# Altium project AMC_FMC_Carrier v2.PrjPcb (part 9 of 9)
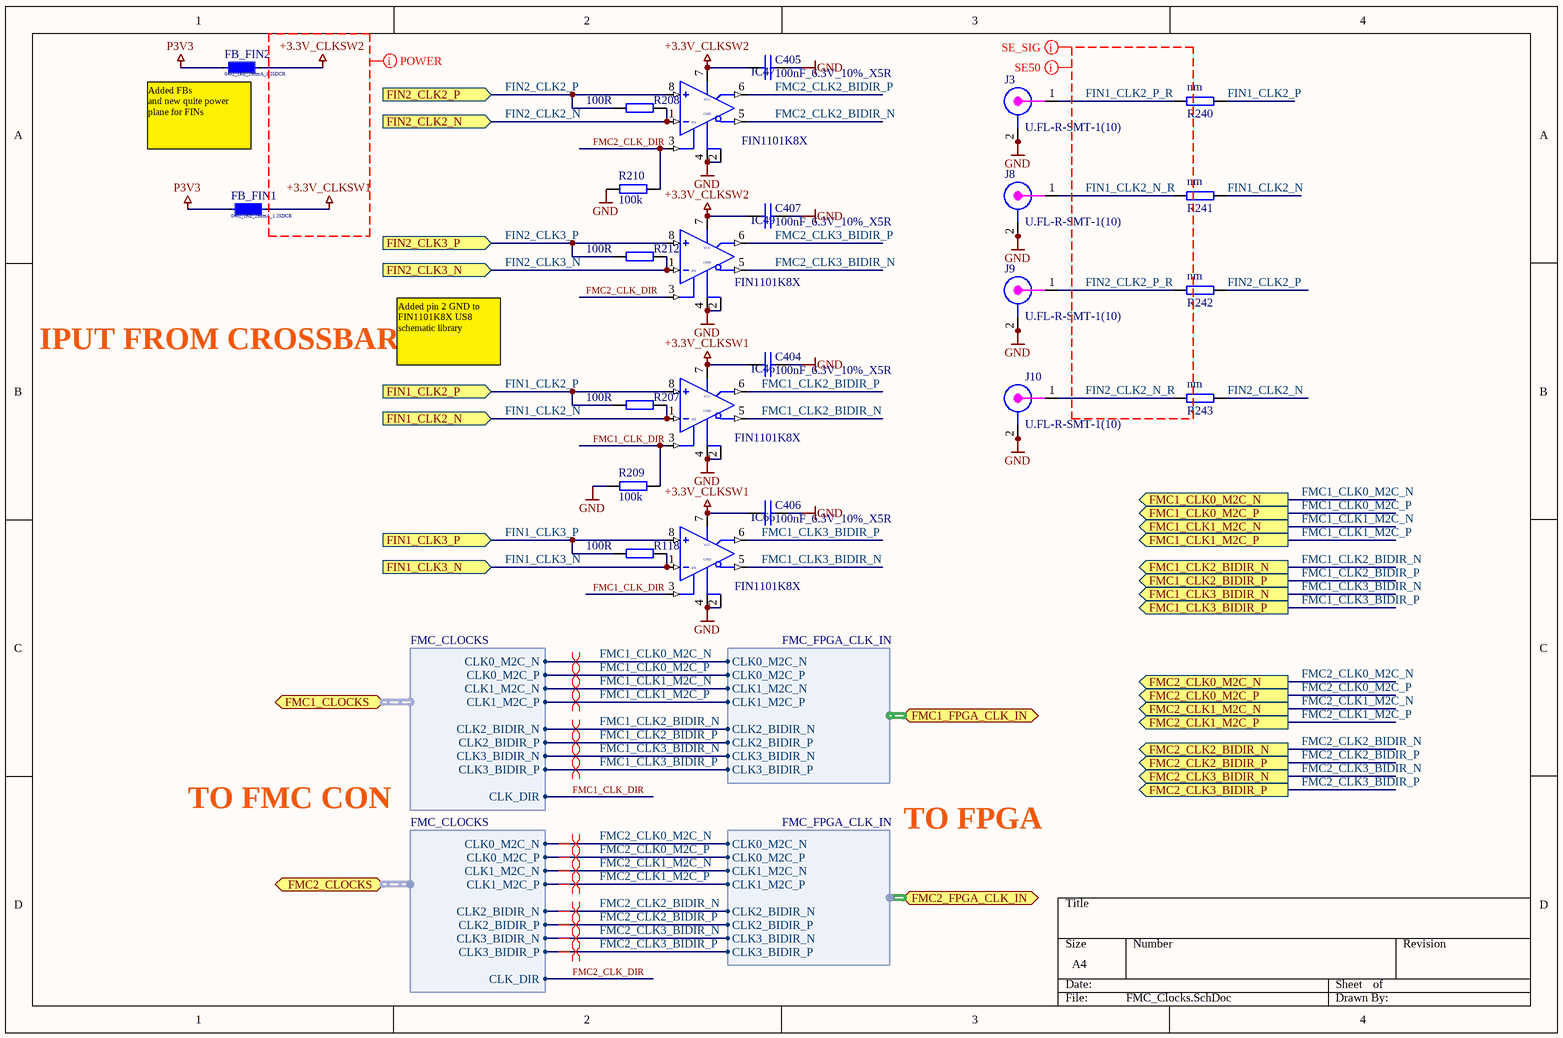
[diagram p21: FMC_Clocks.SchDoc]

## Nets that join several sheets
GND: AMC_FMC_Carrier (43 pins), HPC1 (182 pins), HPC2 (181 pins), FPGA (17 pins), FPGA_SDRAM (5 pins), FMC_HPC1 (16 pins), FMC_HPC2 (7 pins), FPGA_SUP (500 pins), POWER_Management (12 pins), SUP_1.2_1.8 (26 pins), IPMI (5 pins), Thermometers (16 pins), IPMI/UUART (9 pins), JTAG_Configuration (20 pins), M-LVDS PHY (65 pins), UUART (9 pins), Clock_WR (56 pins), FMC_Clocks (22 pins)
MGTAVTT_G10: FPGA_MGT (R239.1), FPGA_SUP (21 pins)
MGTAVTT_G11: FPGA_MGT (R142.1), FPGA_SUP (21 pins)
P1V2: FPGA_SUP (FB7.1 FB8.1), SUP_1.2_1.8 (9 pins)
P1V5: FPGA_SUP (30 pins), M-LVDS PHY (20 pins)
P1V8: FPGA_SUP (L12.1), SUP_1.2_1.8 (9 pins)
P3V3: FPGA (24 pins), FMC_HPC1 (LD1.4), FPGA_SUP (5 pins), POWER_Management (IC58.4 R268.2), JTAG_Configuration (11 pins), M-LVDS PHY (50 pins), Clock_WR (5 pins), FMC_Clocks (FB_FIN1.1 FB_FIN2.1)
P3V3MP: FMC_HPC1 (C102.1 IC56.7 R179.2), POWER_Management (F1.1 F2.1 F3.1), SUP_1.2_1.8 (R66.1 R77.1), Thermometers (19 pins)
P12V: POWER_Management (C88.1 J2.4 R266.2 R267.2), SUP_1.2_1.8 (6 pins)
PVADJ1: HPC1 (8 pins), FMC_HPC1 (C100.1 IC56.2 R83.2 R178.2), FPGA_SUP (70 pins)
PVADJ2: HPC2 (8 pins), FMC_HPC2 (R270.1), FPGA_SUP (69 pins)
3P3VAUX_R: AMC_FMC_Carrier (R124.2), HPC2 (J1B.c34)
CPU.SCL: FMC_HPC1 (IC56.6), Thermometers (5 pins)
CPU.SDA: FMC_HPC1 (IC56.5), Thermometers (5 pins)
DP1.DP0_C2M_N: HPC1 (J1A.c3), FPGA_MGT (C179.1)
DP1.DP0_C2M_P: HPC1 (J1A.c2), FPGA_MGT (C178.1)
DP1.DP0_M2C_N: HPC1 (J1A.c7), FPGA_MGT (C181.1)
DP1.DP0_M2C_P: HPC1 (J1A.c6), FPGA_MGT (C180.1)
DP1.DP1_C2M_N: HPC1 (J1A.a23), FPGA_MGT (C185.1)
DP1.DP1_C2M_P: HPC1 (J1A.a22), FPGA_MGT (C184.1)
DP1.DP1_M2C_N: HPC1 (J1A.a3), FPGA_MGT (C187.1)
DP1.DP1_M2C_P: HPC1 (J1A.a2), FPGA_MGT (C186.1)
DP1.DP2_C2M_N: HPC1 (J1A.a27), FPGA_MGT (C191.1)
DP1.DP2_C2M_P: HPC1 (J1A.a26), FPGA_MGT (C190.1)
DP1.DP2_M2C_N: HPC1 (J1A.a7), FPGA_MGT (C193.1)
DP1.DP2_M2C_P: HPC1 (J1A.a6), FPGA_MGT (C192.1)
DP1.DP3_C2M_N: HPC1 (J1A.a31), FPGA_MGT (C195.1)
DP1.DP3_C2M_P: HPC1 (J1A.a30), FPGA_MGT (C194.1)
DP1.DP3_M2C_N: HPC1 (J1A.a11), FPGA_MGT (C197.1)
DP1.DP3_M2C_P: HPC1 (J1A.a10), FPGA_MGT (C196.1)
DP2.DP0_C2M_N: HPC2 (J1B.c3), FPGA_MGT (C199.1)
DP2.DP0_C2M_P: HPC2 (J1B.c2), FPGA_MGT (C198.1)
DP2.DP0_M2C_N: HPC2 (J1B.c7), FPGA_MGT (C201.1)
DP2.DP0_M2C_P: HPC2 (J1B.c6), FPGA_MGT (C200.1)
DP2.DP1_C2M_N: HPC2 (J1B.a23), FPGA_MGT (C205.1)
DP2.DP1_C2M_P: HPC2 (J1B.a22), FPGA_MGT (C204.1)
DP2.DP1_M2C_N: HPC2 (J1B.a3), FPGA_MGT (C207.1)
DP2.DP1_M2C_P: HPC2 (J1B.a2), FPGA_MGT (C206.1)
DP2.DP2_C2M_N: HPC2 (J1B.a27), FPGA_MGT (C629.1)
DP2.DP2_C2M_P: HPC2 (J1B.a26), FPGA_MGT (C627.1)
DP2.DP2_M2C_N: HPC2 (J1B.a7), FPGA_MGT (C633.1)
DP2.DP2_M2C_P: HPC2 (J1B.a6), FPGA_MGT (C631.1)
DP2.DP3_C2M_N: HPC2 (J1B.a31), FPGA_MGT (C628.1)
DP2.DP3_C2M_P: HPC2 (J1B.a30), FPGA_MGT (C626.1)
DP2.DP3_M2C_N: HPC2 (J1B.a11), FPGA_MGT (C632.1)
DP2.DP3_M2C_P: HPC2 (J1B.a10), FPGA_MGT (C630.1)
FJTAG.TCK: FPGA (IC2.AE12), JTAG_Configuration (IC6.46 R164.1)
FJTAG.TDI: FPGA (IC2.AE14), JTAG_Configuration (IC6.43)
FJTAG.TDO: FPGA (IC2.AD13), JTAG_Configuration (IC6.44)
FJTAG.TMS: FPGA (IC2.AE13), JTAG_Configuration (IC6.45 R225.1)
FLASH_CLK: FPGA (R293.1), FMC_HPC1 (IC2.J8)
FLASH_CSn: FPGA (R299.1), FMC_HPC1 (IC2.J9)
FSPI.FCS_~{B}: FPGA (IC13.1 IC17.7 R127.1), FMC_HPC2 (IC2.Y27)
FSPI.FLASH_D2: FPGA (R126.1 R303.1), FMC_HPC2 (IC2.V26)
FSPI.FLASH_D3: FPGA (R133.1 R304.1), FMC_HPC2 (IC2.V27)
FSPI.FLASH_Q/D1: FPGA (R125.2 R298.2), FMC_HPC2 (IC2.V29)
FSPI.FLASH_SI/D0: FPGA (IC13.5 IC17.15 R291.1), FMC_HPC2 (IC2.V28)
FTMP.DXN: FPGA (IC2.W17), Thermometers (C97.2 R135.1)
FTMP.DXP: FPGA (IC2.W18), Thermometers (C97.1 IC18.3)
GBT1.GBTCLK0_M2C_N: HPC1 (J1A.d5), FPGA_MGT (C183.1)
GBT1.GBTCLK0_M2C_P: HPC1 (J1A.d4), FPGA_MGT (C182.1)
GBT1.GBTCLK1_M2C_N: HPC1 (J1A.b21), FPGA_MGT (C189.1)
GBT1.GBTCLK1_M2C_P: HPC1 (J1A.b20), FPGA_MGT (C188.1)
GBT2.GBTCLK0_M2C_N: HPC2 (J1B.d5), FPGA_MGT (C203.1)
GBT2.GBTCLK0_M2C_P: HPC2 (J1B.d4), FPGA_MGT (C202.1)
GBT2.GBTCLK1_M2C_N: HPC2 (J1B.b21), FPGA_MGT (C635.1)
GBT2.GBTCLK1_M2C_P: HPC2 (J1B.b20), FPGA_MGT (C634.1)
HA1.HA00_CC_N: HPC1 (J1A.f5), FMC_HPC1 (IC2.H29)
HA1.HA00_CC_P: HPC1 (J1A.f4), FMC_HPC1 (IC2.J29)
HA1.HA01_CC_N: HPC1 (J1A.e3), FMC_HPC1 (IC2.K28)
HA1.HA01_CC_P: HPC1 (J1A.e2), FMC_HPC1 (IC2.L28)
HA1.HA02_N: HPC1 (J1A.k8), FMC_HPC1 (IC2.K33)
HA1.HA02_P: HPC1 (J1A.k7), FMC_HPC1 (IC2.J34)
HA1.HA03_N: HPC1 (J1A.j7), FMC_HPC1 (IC2.J30)
HA1.HA03_P: HPC1 (J1A.j6), FMC_HPC1 (IC2.K30)
HA1.HA04_N: HPC1 (J1A.f8), FMC_HPC1 (IC2.L33)
HA1.HA04_P: HPC1 (J1A.f7), FMC_HPC1 (IC2.L34)
HA1.HA05_N: HPC1 (J1A.e7), FMC_HPC1 (IC2.J33)
HA1.HA05_P: HPC1 (J1A.e6), FMC_HPC1 (IC2.H34)
HA1.HA06_N: HPC1 (J1A.k11), FMC_HPC1 (IC2.L27)
HA1.HA06_P: HPC1 (J1A.k10), FMC_HPC1 (IC2.K27)
HA1.HA07_N: HPC1 (J1A.j10), FMC_HPC1 (IC2.L32)
HA1.HA07_P: HPC1 (J1A.j9), FMC_HPC1 (IC2.K32)
HA1.HA08_N: HPC1 (J1A.f11), FMC_HPC1 (IC2.L29)
HA1.HA08_P: HPC1 (J1A.f10), FMC_HPC1 (IC2.L30)
HA1.HA09_N: HPC1 (J1A.e10), FMC_HPC1 (IC2.K31)
HA1.HA09_P: HPC1 (J1A.e9), FMC_HPC1 (IC2.J31)
HA1.HA10_N: HPC1 (J1A.k14), FMC_HPC1 (IC2.H32)
HA1.HA10_P: HPC1 (J1A.k13), FMC_HPC1 (IC2.G32)
HA1.HA11_N: HPC1 (J1A.j13), FMC_HPC1 (IC2.M25)
HA1.HA11_P: HPC1 (J1A.j12), FMC_HPC1 (IC2.L25)
HA1.HA12_N: HPC1 (J1A.f14), FMC_HPC1 (IC2.H33)
HA1.HA12_P: HPC1 (J1A.f13), FMC_HPC1 (IC2.G34)
HA1.HA13_N: HPC1 (J1A.e13), FMC_HPC1 (IC2.J25)
HA1.HA13_P: HPC1 (J1A.e12), FMC_HPC1 (IC2.K25)
HA1.HA14_N: HPC1 (J1A.j16), FMC_HPC1 (IC2.M24)
HA1.HA14_P: HPC1 (J1A.j15), FMC_HPC1 (IC2.L24)
HA1.HA15_N: HPC1 (J1A.f17), FMC_HPC1 (IC2.G29)
HA1.HA15_P: HPC1 (J1A.f16), FMC_HPC1 (IC2.G30)
HA1.HA16_N: HPC1 (J1A.e16), FMC_HPC1 (IC2.H31)
HA1.HA16_P: HPC1 (J1A.e15), FMC_HPC1 (IC2.G31)
HA1.HA17_CC_N: HPC1 (J1A.k17), FMC_HPC1 (IC2.H28)
HA1.HA17_CC_P: HPC1 (J1A.k16), FMC_HPC1 (IC2.J28)
HA1.HA18_N: HPC1 (J1A.j19), FMC_HPC1 (IC2.H27)
HA1.HA18_P: HPC1 (J1A.j18), FMC_HPC1 (IC2.G27)
HA1.HA19_N: HPC1 (J1A.f20), FMC_HPC1 (IC2.H26)
HA1.HA19_P: HPC1 (J1A.f19), FMC_HPC1 (IC2.G26)
HA1.HA20_N: HPC1 (J1A.e19), FMC_HPC1 (IC2.J26)
HA1.HA20_P: HPC1 (J1A.e18), FMC_HPC1 (IC2.K26)
HA1.HA21_N: HPC1 (J1A.k20), FMC_HPC1 (IC2.G24)
HA1.HA21_P: HPC1 (J1A.k19), FMC_HPC1 (IC2.G25)
HA1.HA22_N: HPC1 (J1A.j22), FMC_HPC1 (IC2.J24)
HA1.HA22_P: HPC1 (J1A.j21), FMC_HPC1 (IC2.H24)
HA1.HA23_N: HPC1 (J1A.k23), FMC_HPC1 (IC2.K23)
HA1.HA23_P: HPC1 (J1A.k22), FMC_HPC1 (IC2.J23)
HA2.HA00_CC_N: HPC2 (J1B.f5), FMC_HPC2 (IC2.AL30)
HA2.HA00_CC_P: HPC2 (J1B.f4), FMC_HPC2 (IC2.AM30)
HA2.HA01_CC_N: HPC2 (J1B.e3), FMC_HPC2 (IC2.AL29)
HA2.HA01_CC_P: HPC2 (J1B.e2), FMC_HPC2 (IC2.AL28)
HA2.HA02_N: HPC2 (J1B.k8), FMC_HPC2 (IC2.AN31)
HA2.HA02_P: HPC2 (J1B.k7), FMC_HPC2 (IC2.AP31)
HA2.HA03_N: HPC2 (J1B.j7), FMC_HPC2 (IC2.AN26)
HA2.HA03_P: HPC2 (J1B.j6), FMC_HPC2 (IC2.AM26)
HA2.HA04_N: HPC2 (J1B.f8), FMC_HPC2 (IC2.AJ25)
HA2.HA04_P: HPC2 (J1B.f7), FMC_HPC2 (IC2.AK25)
HA2.HA05_N: HPC2 (J1B.e7), FMC_HPC2 (IC2.AM25)
HA2.HA05_P: HPC2 (J1B.e6), FMC_HPC2 (IC2.AL25)
HA2.HA06_N: HPC2 (J1B.k11), FMC_HPC2 (IC2.AL32)
HA2.HA06_P: HPC2 (J1B.k10), FMC_HPC2 (IC2.AM32)
HA2.HA07_N: HPC2 (J1B.j10), FMC_HPC2 (IC2.AM31)
HA2.HA07_P: HPC2 (J1B.j9), FMC_HPC2 (IC2.AN32)
HA2.HA08_N: HPC2 (J1B.f11), FMC_HPC2 (IC2.AM27)
HA2.HA08_P: HPC2 (J1B.f10), FMC_HPC2 (IC2.AN27)
HA2.HA09_N: HPC2 (J1B.e10), FMC_HPC2 (IC2.AJ26)
HA2.HA09_P: HPC2 (J1B.e9), FMC_HPC2 (IC2.AK26)
HA2.HA10_N: HPC2 (J1B.k14), FMC_HPC2 (IC2.AP26)
HA2.HA10_P: HPC2 (J1B.k13), FMC_HPC2 (IC2.AP25)
HA2.HA11_N: HPC2 (J1B.j13), FMC_HPC2 (IC2.AK33)
HA2.HA11_P: HPC2 (J1B.j12), FMC_HPC2 (IC2.AL33)
HA2.HA12_N: HPC2 (J1B.f14), FMC_HPC2 (IC2.AM29)
HA2.HA12_P: HPC2 (J1B.f13), FMC_HPC2 (IC2.AN29)
HA2.HA13_N: HPC2 (J1B.e13), FMC_HPC2 (IC2.AN28)
HA2.HA13_P: HPC2 (J1B.e12), FMC_HPC2 (IC2.AP28)
HA2.HA14_N: HPC2 (J1B.j16), FMC_HPC2 (IC2.AN34)
HA2.HA14_P: HPC2 (J1B.j15), FMC_HPC2 (IC2.AP34)
HA2.HA15_N: HPC2 (J1B.f17), FMC_HPC2 (IC2.AK30)
HA2.HA15_P: HPC2 (J1B.f16), FMC_HPC2 (IC2.AJ29)
HA2.HA16_N: HPC2 (J1B.e16), FMC_HPC2 (IC2.AK27)
HA2.HA16_P: HPC2 (J1B.e15), FMC_HPC2 (IC2.AL27)
HA2.HA17_CC_N: HPC2 (J1B.k17), FMC_HPC2 (IC2.AJ28)
HA2.HA17_CC_P: HPC2 (J1B.k16), FMC_HPC2 (IC2.AK28)
HA2.HA18_N: HPC2 (J1B.j19), FMC_HPC2 (IC2.AN33)
HA2.HA18_P: HPC2 (J1B.j18), FMC_HPC2 (IC2.AP33)
HA2.HA19_N: HPC2 (J1B.f20), FMC_HPC2 (IC2.AJ30)
HA2.HA19_P: HPC2 (J1B.f19), FMC_HPC2 (IC2.AK31)
HA2.HA20_N: HPC2 (J1B.e19), FMC_HPC2 (IC2.AJ31)
HA2.HA20_P: HPC2 (J1B.e18), FMC_HPC2 (IC2.AK32)
HA2.HA21_N: HPC2 (J1B.k20), FMC_HPC2 (IC2.AP30)
HA2.HA21_P: HPC2 (J1B.k19), FMC_HPC2 (IC2.AP29)
HA2.HA22_N: HPC2 (J1B.j22), FMC_HPC2 (IC2.AL34)
HA2.HA22_P: HPC2 (J1B.j21), FMC_HPC2 (IC2.AM34)
HA2.HA23_N: HPC2 (J1B.k23), FMC_HPC2 (IC2.AJ33)
HA2.HA23_P: HPC2 (J1B.k22), FMC_HPC2 (IC2.AJ34)
HB1.HB00_CC_N: HPC1 (J1A.k26), FMC_HPC1 (IC2.W5)
HB1.HB00_CC_P: HPC1 (J1A.k25), FMC_HPC1 (IC2.Y5)
HB1.HB01_N: HPC1 (J1A.j25), FMC_HPC1 (IC2.W8)
HB1.HB01_P: HPC1 (J1A.j24), FMC_HPC1 (IC2.W9)
HB1.HB02_N: HPC1 (J1A.f23), FMC_HPC1 (IC2.V8)
HB1.HB02_P: HPC1 (J1A.f22), FMC_HPC1 (IC2.V9)
HB1.HB03_N: HPC1 (J1A.e22), FMC_HPC1 (IC2.Y10)
HB1.HB03_P: HPC1 (J1A.e21), FMC_HPC1 (IC2.W10)
HB1.HB04_N: HPC1 (J1A.f26), FMC_HPC1 (IC2.Y7)
HB1.HB04_P: HPC1 (J1A.f25), FMC_HPC1 (IC2.Y8)
HB1.HB05_N: HPC1 (J1A.e25), FMC_HPC1 (IC2.AA9)
HB1.HB05_P: HPC1 (J1A.e24), FMC_HPC1 (IC2.AA10)
HB1.HB06_CC_N: HPC1 (J1A.k29), FMC_HPC1 (IC2.W4)
HB1.HB06_CC_P: HPC1 (J1A.k28), FMC_HPC1 (IC2.V4)
HB1.HB07_N: HPC1 (J1A.j28), FMC_HPC1 (IC2.AB9)
HB1.HB07_P: HPC1 (J1A.j27), FMC_HPC1 (IC2.AB10)
HB1.HB08_N: HPC1 (J1A.f29), FMC_HPC1 (IC2.W3)
HB1.HB08_P: HPC1 (J1A.f28), FMC_HPC1 (IC2.V3)
HB1.HB09_N: HPC1 (J1A.e28), FMC_HPC1 (IC2.V1)
HB1.HB09_P: HPC1 (J1A.e27), FMC_HPC1 (IC2.V2)
HB1.HB10_N: HPC1 (J1A.k32), FMC_HPC1 (IC2.V6)
HB1.HB10_P: HPC1 (J1A.k31), FMC_HPC1 (IC2.V7)
HB1.HB11_N: HPC1 (J1A.j31), FMC_HPC1 (IC2.Y1)
HB1.HB11_P: HPC1 (J1A.j30), FMC_HPC1 (IC2.W1)
HB1.HB12_N: HPC1 (J1A.f32), FMC_HPC1 (IC2.AC6)
HB1.HB12_P: HPC1 (J1A.f31), FMC_HPC1 (IC2.AC7)
HB1.HB13_N: HPC1 (J1A.e31), FMC_HPC1 (IC2.Y2)
HB1.HB13_P: HPC1 (J1A.e30), FMC_HPC1 (IC2.Y3)
HB1.HB14_N: HPC1 (J1A.k35), FMC_HPC1 (IC2.AC1)
HB1.HB14_P: HPC1 (J1A.k34), FMC_HPC1 (IC2.AC2)
HB1.HB15_N: HPC1 (J1A.j34), FMC_HPC1 (IC2.AC8)
HB1.HB15_P: HPC1 (J1A.j33), FMC_HPC1 (IC2.AC9)
HB1.HB16_N: HPC1 (J1A.f35), FMC_HPC1 (IC2.AB1)
HB1.HB16_P: HPC1 (J1A.f34), FMC_HPC1 (IC2.AB2)
HB1.HB17_CC_N: HPC1 (J1A.k38), FMC_HPC1 (IC2.AA4)
HB1.HB17_CC_P: HPC1 (J1A.k37), FMC_HPC1 (IC2.AA5)
HB1.HB18_N: HPC1 (J1A.j37), FMC_HPC1 (IC2.AB6)
HB1.HB18_P: HPC1 (J1A.j36), FMC_HPC1 (IC2.AB7)
HB1.HB19_N: HPC1 (J1A.e34), FMC_HPC1 (IC2.AB4)
HB1.HB19_P: HPC1 (J1A.e33), FMC_HPC1 (IC2.AB5)
HB1.HB20_N: HPC1 (J1A.f38), FMC_HPC1 (IC2.AA2)
HB1.HB20_P: HPC1 (J1A.f37), FMC_HPC1 (IC2.AA3)
HB1.HB21_N: HPC1 (J1A.e37), FMC_HPC1 (IC2.AC4)
HB1.HB21_P: HPC1 (J1A.e36), FMC_HPC1 (IC2.AC3)
HB2.HB00_CC_N: HPC2 (J1B.k26), FMC_HPC2 (IC2.T29)
HB2.HB00_CC_P: HPC2 (J1B.k25), FMC_HPC2 (IC2.U29)
HB2.HB01_N: HPC2 (J1B.j25), FMC_HPC2 (IC2.N26)
HB2.HB01_P: HPC2 (J1B.j24), FMC_HPC2 (IC2.M27)
HB2.HB02_N: HPC2 (J1B.f23), FMC_HPC2 (IC2.N34)
HB2.HB02_P: HPC2 (J1B.f22), FMC_HPC2 (IC2.M34)
HB2.HB03_N: HPC2 (J1B.e22), FMC_HPC2 (IC2.T34)
HB2.HB03_P: HPC2 (J1B.e21), FMC_HPC2 (IC2.U34)
HB2.HB04_N: HPC2 (J1B.f26), FMC_HPC2 (IC2.U27)
HB2.HB04_P: HPC2 (J1B.f25), FMC_HPC2 (IC2.U26)
HB2.HB05_N: HPC2 (J1B.e25), FMC_HPC2 (IC2.P34)
HB2.HB05_P: HPC2 (J1B.e24), FMC_HPC2 (IC2.P33)
HB2.HB06_CC_N: HPC2 (J1B.k29), FMC_HPC2 (IC2.P30)
HB2.HB06_CC_P: HPC2 (J1B.k28), FMC_HPC2 (IC2.R30)
HB2.HB07_N: HPC2 (J1B.j28), FMC_HPC2 (IC2.P24)
HB2.HB07_P: HPC2 (J1B.j27), FMC_HPC2 (IC2.N24)
HB2.HB08_N: HPC2 (J1B.f29), FMC_HPC2 (IC2.P26)
HB2.HB08_P: HPC2 (J1B.f28), FMC_HPC2 (IC2.R26)
HB2.HB09_N: HPC2 (J1B.e28), FMC_HPC2 (IC2.R28)
HB2.HB09_P: HPC2 (J1B.e27), FMC_HPC2 (IC2.T28)
HB2.HB10_N: HPC2 (J1B.k32), FMC_HPC2 (IC2.U25)
HB2.HB10_P: HPC2 (J1B.k31), FMC_HPC2 (IC2.T25)
HB2.HB11_N: HPC2 (J1B.j31), FMC_HPC2 (IC2.T27)
HB2.HB11_P: HPC2 (J1B.j30), FMC_HPC2 (IC2.R27)
HB2.HB12_N: HPC2 (J1B.f32), FMC_HPC2 (IC2.M32)
HB2.HB12_P: HPC2 (J1B.f31), FMC_HPC2 (IC2.N31)
HB2.HB13_N: HPC2 (J1B.e31), FMC_HPC2 (IC2.N28)
HB2.HB13_P: HPC2 (J1B.e30), FMC_HPC2 (IC2.N27)
HB2.HB14_N: HPC2 (J1B.k35), FMC_HPC2 (IC2.P31)
HB2.HB14_P: HPC2 (J1B.k34), FMC_HPC2 (IC2.R31)
HB2.HB15_N: HPC2 (J1B.j34), FMC_HPC2 (IC2.T30)
HB2.HB15_P: HPC2 (J1B.j33), FMC_HPC2 (IC2.U30)
HB2.HB16_N: HPC2 (J1B.f35), FMC_HPC2 (IC2.U31)
HB2.HB16_P: HPC2 (J1B.f34), FMC_HPC2 (IC2.U32)
HB2.HB17_CC_N: HPC2 (J1B.k38), FMC_HPC2 (IC2.P28)
HB2.HB17_CC_P: HPC2 (J1B.k37), FMC_HPC2 (IC2.P29)
HB2.HB18_N: HPC2 (J1B.j37), FMC_HPC2 (IC2.M29)
HB2.HB18_P: HPC2 (J1B.j36), FMC_HPC2 (IC2.N29)
HB2.HB19_N: HPC2 (J1B.e34), FMC_HPC2 (IC2.M30)
HB2.HB19_P: HPC2 (J1B.e33), FMC_HPC2 (IC2.M31)
HB2.HB20_N: HPC2 (J1B.f38), FMC_HPC2 (IC2.N33)
HB2.HB20_P: HPC2 (J1B.f37), FMC_HPC2 (IC2.N32)
HB2.HB21_N: HPC2 (J1B.e37), FMC_HPC2 (IC2.R33)
HB2.HB21_P: HPC2 (J1B.e36), FMC_HPC2 (IC2.T33)
JTAG1.TCK: HPC1 (J1A.d29), JTAG_Configuration (IC6.37)
JTAG1.TDI: HPC1 (J1A.d30), JTAG_Configuration (IC6.32)
JTAG1.TDO: HPC1 (J1A.d31), JTAG_Configuration (IC6.33)
JTAG1.TMS: HPC1 (J1A.d33), JTAG_Configuration (IC6.34)
JTAG1.TRST_L: HPC1 (J1A.d34), JTAG_Configuration (IC6.38)
JTAG2.TCK: HPC2 (J1B.d29), JTAG_Configuration (IC6.26)
JTAG2.TDI: HPC2 (J1B.d30), JTAG_Configuration (IC6.20)
JTAG2.TDO: HPC2 (J1B.d31), JTAG_Configuration (IC6.19)
JTAG2.TMS: HPC2 (J1B.d33), JTAG_Configuration (IC6.23)
JTAG2.TRST_L: HPC2 (J1B.d34), JTAG_Configuration (IC6.27)
LA1.LA00_CC_N: HPC1 (J1A.g7), FMC_HPC1 (IC2.K6)
LA1.LA00_CC_P: HPC1 (J1A.g6), FMC_HPC1 (IC2.K7)
LA1.LA01_CC_N: HPC1 (J1A.d9), FMC_HPC1 (IC2.J5)
LA1.LA01_CC_P: HPC1 (J1A.d8), FMC_HPC1 (IC2.J6)
LA1.LA02_N: HPC1 (J1A.h8), FMC_HPC1 (IC2.G6)
LA1.LA02_P: HPC1 (J1A.h7), FMC_HPC1 (IC2.G7)
LA1.LA03_N: HPC1 (J1A.g10), FMC_HPC1 (IC2.H1)
LA1.LA03_P: HPC1 (J1A.g9), FMC_HPC1 (IC2.G1)
LA1.LA04_N: HPC1 (J1A.h11), FMC_HPC1 (IC2.K1)
LA1.LA04_P: HPC1 (J1A.h10), FMC_HPC1 (IC2.J1)
LA1.LA05_N: HPC1 (J1A.d12), FMC_HPC1 (IC2.H3)
LA1.LA05_P: HPC1 (J1A.d11), FMC_HPC1 (IC2.H4)
LA1.LA06_N: HPC1 (J1A.c11), FMC_HPC1 (IC2.L5)
LA1.LA06_P: HPC1 (J1A.c10), FMC_HPC1 (IC2.K5)
LA1.LA07_N: HPC1 (J1A.h14), FMC_HPC1 (IC2.K2)
LA1.LA07_P: HPC1 (J1A.h13), FMC_HPC1 (IC2.K3)
LA1.LA08_N: HPC1 (J1A.g13), FMC_HPC1 (IC2.F2)
LA1.LA08_P: HPC1 (J1A.g12), FMC_HPC1 (IC2.F3)
LA1.LA09_N: HPC1 (J1A.d15), FMC_HPC1 (IC2.J3)
LA1.LA09_P: HPC1 (J1A.d14), FMC_HPC1 (IC2.J4)
LA1.LA10_N: HPC1 (J1A.c15), FMC_HPC1 (IC2.H2)
LA1.LA10_P: HPC1 (J1A.c14), FMC_HPC1 (IC2.G2)
LA1.LA11_N: HPC1 (J1A.h17), FMC_HPC1 (IC2.M2)
LA1.LA11_P: HPC1 (J1A.h16), FMC_HPC1 (IC2.L2)
LA1.LA12_N: HPC1 (J1A.g16), FMC_HPC1 (IC2.L8)
LA1.LA12_P: HPC1 (J1A.g15), FMC_HPC1 (IC2.K8)
LA1.LA13_N: HPC1 (J1A.d18), FMC_HPC1 (IC2.G9)
LA1.LA13_P: HPC1 (J1A.d17), FMC_HPC1 (IC2.G10)
LA1.LA14_N: HPC1 (J1A.c19), FMC_HPC1 (IC2.H8)
LA1.LA14_P: HPC1 (J1A.c18), FMC_HPC1 (IC2.H9)
LA1.LA15_N: HPC1 (J1A.h20), FMC_HPC1 (IC2.K11)
LA1.LA15_P: HPC1 (J1A.h19), FMC_HPC1 (IC2.J11)
LA1.LA16_N: HPC1 (J1A.g19), FMC_HPC1 (IC2.L9)
LA1.LA16_P: HPC1 (J1A.g18), FMC_HPC1 (IC2.L10)
LA1.LA17_CC_N: HPC1 (J1A.d21), FMC_HPC1 (IC2.T4)
LA1.LA17_CC_P: HPC1 (J1A.d20), FMC_HPC1 (IC2.T5)
LA1.LA18_CC_N: HPC1 (J1A.c23), FMC_HPC1 (IC2.P3)
LA1.LA18_CC_P: HPC1 (J1A.c22), FMC_HPC1 (IC2.P4)
LA1.LA19_N: HPC1 (J1A.h23), FMC_HPC1 (IC2.U4)
LA1.LA19_P: HPC1 (J1A.h22), FMC_HPC1 (IC2.U5)
LA1.LA20_N: HPC1 (J1A.g22), FMC_HPC1 (IC2.R10)
LA1.LA20_P: HPC1 (J1A.g21), FMC_HPC1 (IC2.P10)
LA1.LA21_N: HPC1 (J1A.h26), FMC_HPC1 (IC2.M7)
LA1.LA21_P: HPC1 (J1A.h25), FMC_HPC1 (IC2.M6)
LA1.LA22_N: HPC1 (J1A.g25), FMC_HPC1 (IC2.M4)
LA1.LA22_P: HPC1 (J1A.g24), FMC_HPC1 (IC2.M5)
LA1.LA23_N: HPC1 (J1A.d24), FMC_HPC1 (IC2.N3)
LA1.LA23_P: HPC1 (J1A.d23), FMC_HPC1 (IC2.N2)
LA1.LA24_N: HPC1 (J1A.h29), FMC_HPC1 (IC2.M11)
LA1.LA24_P: HPC1 (J1A.h28), FMC_HPC1 (IC2.M10)
LA1.LA25_N: HPC1 (J1A.g28), FMC_HPC1 (IC2.N8)
LA1.LA25_P: HPC1 (J1A.g27), FMC_HPC1 (IC2.N7)
LA1.LA26_N: HPC1 (J1A.d27), FMC_HPC1 (IC2.T2)
LA1.LA26_P: HPC1 (J1A.d26), FMC_HPC1 (IC2.T3)
LA1.LA27_N: HPC1 (J1A.c27), FMC_HPC1 (IC2.R2)
LA1.LA27_P: HPC1 (J1A.c26), FMC_HPC1 (IC2.R3)
LA1.LA28_N: HPC1 (J1A.h32), FMC_HPC1 (IC2.T7)
LA1.LA28_P: HPC1 (J1A.h31), FMC_HPC1 (IC2.T8)
LA1.LA29_N: HPC1 (J1A.g31), FMC_HPC1 (IC2.P9)
LA1.LA29_P: HPC1 (J1A.g30), FMC_HPC1 (IC2.P8)
LA1.LA30_N: HPC1 (J1A.h35), FMC_HPC1 (IC2.M1)
LA1.LA30_P: HPC1 (J1A.h34), FMC_HPC1 (IC2.N1)
LA1.LA31_N: HPC1 (J1A.g34), FMC_HPC1 (IC2.U7)
LA1.LA31_P: HPC1 (J1A.g33), FMC_HPC1 (IC2.U6)
LA1.LA32_N: HPC1 (J1A.h38), FMC_HPC1 (IC2.P1)
LA1.LA32_P: HPC1 (J1A.h37), FMC_HPC1 (IC2.R1)
LA1.LA33_N: HPC1 (J1A.g37), FMC_HPC1 (IC2.U2)
LA1.LA33_P: HPC1 (J1A.g36), FMC_HPC1 (IC2.U1)
LA2.LA00_CC_N: HPC2 (J1B.g7), FMC_HPC2 (IC2.AF28)
LA2.LA00_CC_P: HPC2 (J1B.g6), FMC_HPC2 (IC2.AE28)
LA2.LA01_CC_N: HPC2 (J1B.d9), FMC_HPC2 (IC2.AF29)
LA2.LA01_CC_P: HPC2 (J1B.d8), FMC_HPC2 (IC2.AF30)
LA2.LA02_N: HPC2 (J1B.h8), FMC_HPC2 (IC2.AG31)
LA2.LA02_P: HPC2 (J1B.h7), FMC_HPC2 (IC2.AH31)
LA2.LA03_N: HPC2 (J1B.g10), FMC_HPC2 (IC2.AG24)
LA2.LA03_P: HPC2 (J1B.g9), FMC_HPC2 (IC2.AH24)
LA2.LA04_N: HPC2 (J1B.h11), FMC_HPC2 (IC2.AC26)
LA2.LA04_P: HPC2 (J1B.h10), FMC_HPC2 (IC2.AC27)
LA2.LA05_N: HPC2 (J1B.d12), FMC_HPC2 (IC2.AH33)
LA2.LA05_P: HPC2 (J1B.d11), FMC_HPC2 (IC2.AH34)
LA2.LA06_N: HPC2 (J1B.c11), FMC_HPC2 (IC2.AF23)
LA2.LA06_P: HPC2 (J1B.c10), FMC_HPC2 (IC2.AE23)
LA2.LA07_N: HPC2 (J1B.h14), FMC_HPC2 (IC2.AG27)
LA2.LA07_P: HPC2 (J1B.h13), FMC_HPC2 (IC2.AH27)
LA2.LA08_N: HPC2 (J1B.g13), FMC_HPC2 (IC2.AE25)
LA2.LA08_P: HPC2 (J1B.g12), FMC_HPC2 (IC2.AD25)
LA2.LA09_N: HPC2 (J1B.d15), FMC_HPC2 (IC2.AF25)
LA2.LA09_P: HPC2 (J1B.d14), FMC_HPC2 (IC2.AG25)
LA2.LA10_N: HPC2 (J1B.c15), FMC_HPC2 (IC2.AG32)
LA2.LA10_P: HPC2 (J1B.c14), FMC_HPC2 (IC2.AH32)
LA2.LA11_N: HPC2 (J1B.h17), FMC_HPC2 (IC2.AD30)
LA2.LA11_P: HPC2 (J1B.h16), FMC_HPC2 (IC2.AE30)
LA2.LA12_N: HPC2 (J1B.g16), FMC_HPC2 (IC2.AE27)
LA2.LA12_P: HPC2 (J1B.g15), FMC_HPC2 (IC2.AF27)
LA2.LA13_N: HPC2 (J1B.d18), FMC_HPC2 (IC2.AF34)
LA2.LA13_P: HPC2 (J1B.d17), FMC_HPC2 (IC2.AG34)
LA2.LA14_N: HPC2 (J1B.c19), FMC_HPC2 (IC2.AE33)
LA2.LA14_P: HPC2 (J1B.c18), FMC_HPC2 (IC2.AF33)
LA2.LA15_N: HPC2 (J1B.h20), FMC_HPC2 (IC2.AD28)
LA2.LA15_P: HPC2 (J1B.h19), FMC_HPC2 (IC2.AD29)
LA2.LA16_N: HPC2 (J1B.g19), FMC_HPC2 (IC2.AD34)
LA2.LA16_P: HPC2 (J1B.g18), FMC_HPC2 (IC2.AD33)
LA2.LA17_CC_N: HPC2 (J1B.d21), FMC_HPC2 (IC2.AB31)
LA2.LA17_CC_P: HPC2 (J1B.d20), FMC_HPC2 (IC2.AB32)
LA2.LA18_CC_N: HPC2 (J1B.c23), FMC_HPC2 (IC2.W31)
LA2.LA18_CC_P: HPC2 (J1B.c22), FMC_HPC2 (IC2.W30)
LA2.LA19_N: HPC2 (J1B.h23), FMC_HPC2 (IC2.AB26)
LA2.LA19_P: HPC2 (J1B.h22), FMC_HPC2 (IC2.AB27)
LA2.LA20_N: HPC2 (J1B.g22), FMC_HPC2 (IC2.AB25)
LA2.LA20_P: HPC2 (J1B.g21), FMC_HPC2 (IC2.AB24)
LA2.LA21_N: HPC2 (J1B.h26), FMC_HPC2 (IC2.AA32)
LA2.LA21_P: HPC2 (J1B.h25), FMC_HPC2 (IC2.AA33)
LA2.LA22_N: HPC2 (J1B.g25), FMC_HPC2 (IC2.AA24)
LA2.LA22_P: HPC2 (J1B.g24), FMC_HPC2 (IC2.AA25)
LA2.LA23_N: HPC2 (J1B.d24), FMC_HPC2 (IC2.W25)
LA2.LA23_P: HPC2 (J1B.d23), FMC_HPC2 (IC2.Y25)
LA2.LA24_N: HPC2 (J1B.h29), FMC_HPC2 (IC2.Y33)
LA2.LA24_P: HPC2 (J1B.h28), FMC_HPC2 (IC2.Y32)
LA2.LA25_N: HPC2 (J1B.g28), FMC_HPC2 (IC2.AA29)
LA2.LA25_P: HPC2 (J1B.g27), FMC_HPC2 (IC2.AB29)
LA2.LA26_N: HPC2 (J1B.d27), FMC_HPC2 (IC2.AC31)
LA2.LA26_P: HPC2 (J1B.d26), FMC_HPC2 (IC2.AC32)
LA2.LA27_N: HPC2 (J1B.c27), FMC_HPC2 (IC2.AA28)
LA2.LA27_P: HPC2 (J1B.c26), FMC_HPC2 (IC2.AA27)
LA2.LA28_N: HPC2 (J1B.h32), FMC_HPC2 (IC2.W28)
LA2.LA28_P: HPC2 (J1B.h31), FMC_HPC2 (IC2.W29)
LA2.LA29_N: HPC2 (J1B.g31), FMC_HPC2 (IC2.AC33)
LA2.LA29_P: HPC2 (J1B.g30), FMC_HPC2 (IC2.AC34)
LA2.LA30_N: HPC2 (J1B.h35), FMC_HPC2 (IC2.W34)
LA2.LA30_P: HPC2 (J1B.h34), FMC_HPC2 (IC2.W33)
LA2.LA31_N: HPC2 (J1B.g34), FMC_HPC2 (IC2.V31)
LA2.LA31_P: HPC2 (J1B.g33), FMC_HPC2 (IC2.V32)
LA2.LA32_N: HPC2 (J1B.h38), FMC_HPC2 (IC2.AB34)
LA2.LA32_P: HPC2 (J1B.h37), FMC_HPC2 (IC2.AA34)
LA2.LA33_N: HPC2 (J1B.g37), FMC_HPC2 (IC2.V34)
LA2.LA33_P: HPC2 (J1B.g36), FMC_HPC2 (IC2.V33)
MLVDS_F.IO_RX_P17: FPGA_SDRAM (IC2.AM9), M-LVDS PHY (IC28.3)
MLVDS_F.IO_RX_P18: FPGA_SDRAM (IC2.AP10), M-LVDS PHY (IC34.3)
MLVDS_F.IO_RX_P19: FPGA_SDRAM (IC2.AN8), M-LVDS PHY (IC36.3)
MLVDS_F.IO_RX_P20: FPGA_SDRAM (IC2.AL8), M-LVDS PHY (IC38.3)
MLVDS_F.IO_TX_P17: FPGA_SDRAM (IC2.AP11), M-LVDS PHY (IC29.3)
MLVDS_F.IO_TX_P18: FPGA_SDRAM (IC2.AM11), M-LVDS PHY (IC35.3)
MLVDS_F.IO_TX_P19: FPGA_SDRAM (IC2.AP8), M-LVDS PHY (IC37.3)
MLVDS_F.IO_TX_P20: FPGA_SDRAM (IC2.AL9), M-LVDS PHY (IC39.3)
MLVDS_F.~{RE}_DE_RX_P17: FPGA_SDRAM (IC2.AJ10), M-LVDS PHY (IC28.5 IC40.10)
MLVDS_F.~{RE}_DE_RX_P18: FPGA_SDRAM (IC2.AJ11), M-LVDS PHY (IC34.5 IC40.8)
MLVDS_F.~{RE}_DE_RX_P19: FPGA_SDRAM (IC2.AM10), M-LVDS PHY (IC36.5 IC40.6)
MLVDS_F.~{RE}_DE_RX_P20: FPGA_SDRAM (IC2.AN9), M-LVDS PHY (IC38.5 IC40.4)
MLVDS_F.~{RE}_DE_TX_P17: FPGA_SDRAM (IC2.AK11), M-LVDS PHY (IC29.5 IC40.9)
MLVDS_F.~{RE}_DE_TX_P18: FPGA_SDRAM (IC2.AL10), M-LVDS PHY (IC35.5 IC40.7)
MLVDS_F.~{RE}_DE_TX_P19: FPGA_SDRAM (IC2.AN11), M-LVDS PHY (IC37.5 IC40.5)
MLVDS_F.~{RE}_DE_TX_P20: FPGA_SDRAM (IC2.AP9), M-LVDS PHY (IC39.5 IC40.3)
PM.PGOOD_P1V0: POWER_Management (C20.1 IC58.3 R268.1), SUP_1.2_1.8 (R289.1 R290.1)
POWER1.3P3VAUX: HPC1 (C16A.1 C17A.1 J1A.d32), POWER_Management (F1.2)
POWER1.12P0V: HPC1 (7 pins), POWER_Management (5 pins)
POWER2.3P3VAUX: AMC_FMC_Carrier (R124.1), HPC2 (C16B.1 C17B.1 J1B.d32), POWER_Management (F2.2)
POWER2.12P0V: HPC2 (7 pins), POWER_Management (5 pins)
RxD_USB: FMC_HPC1 (IC2.Y11 TP13.1), UUART (R276B.1)
TxD_USB: FMC_HPC1 (IC2.AB11 TP4.1), UUART (R275B.1)
VREF1.VREF_A_M2C: HPC1 (J1A.h1), FMC_HPC1 (8 pins)
VREF1.VREF_B_M2C: HPC1 (J1A.k1), FMC_HPC1 (C114.1 C121.1 IC2.AA7 IC2.Y6)
VREF2.VREF_A_M2C: HPC2 (J1B.h1), FMC_HPC2 (8 pins)
VREF2.VREF_B_M2C: HPC2 (J1B.k1), FMC_HPC2 (C129.1 C392.1 IC2.P25 IC2.R32)